# Altium schematic sheet FrontEnd_PS.SchDoc: FMC SDR Frontend
size 420 x 297 mm; CheckedBy: -; CompanyName: CERN; DrawnBy: DrawnBy; Organization: CERN; Address1: European Organization for Nuclear Research; Address2: CH-1211 Genčve 23 - Switzerland; Revision: -; SheetNumber: -; SheetTotal: -; EDA_Number: EDA-XXXXX-VX-X; Projet: -; ModifiedBy: -; CreateDate: XX/XX/XXXX; CheckedDate: -; Title2: Power Supply Top sheet; DivGrp: TE/MPE; Designer: Designer; ModifiedDate: -
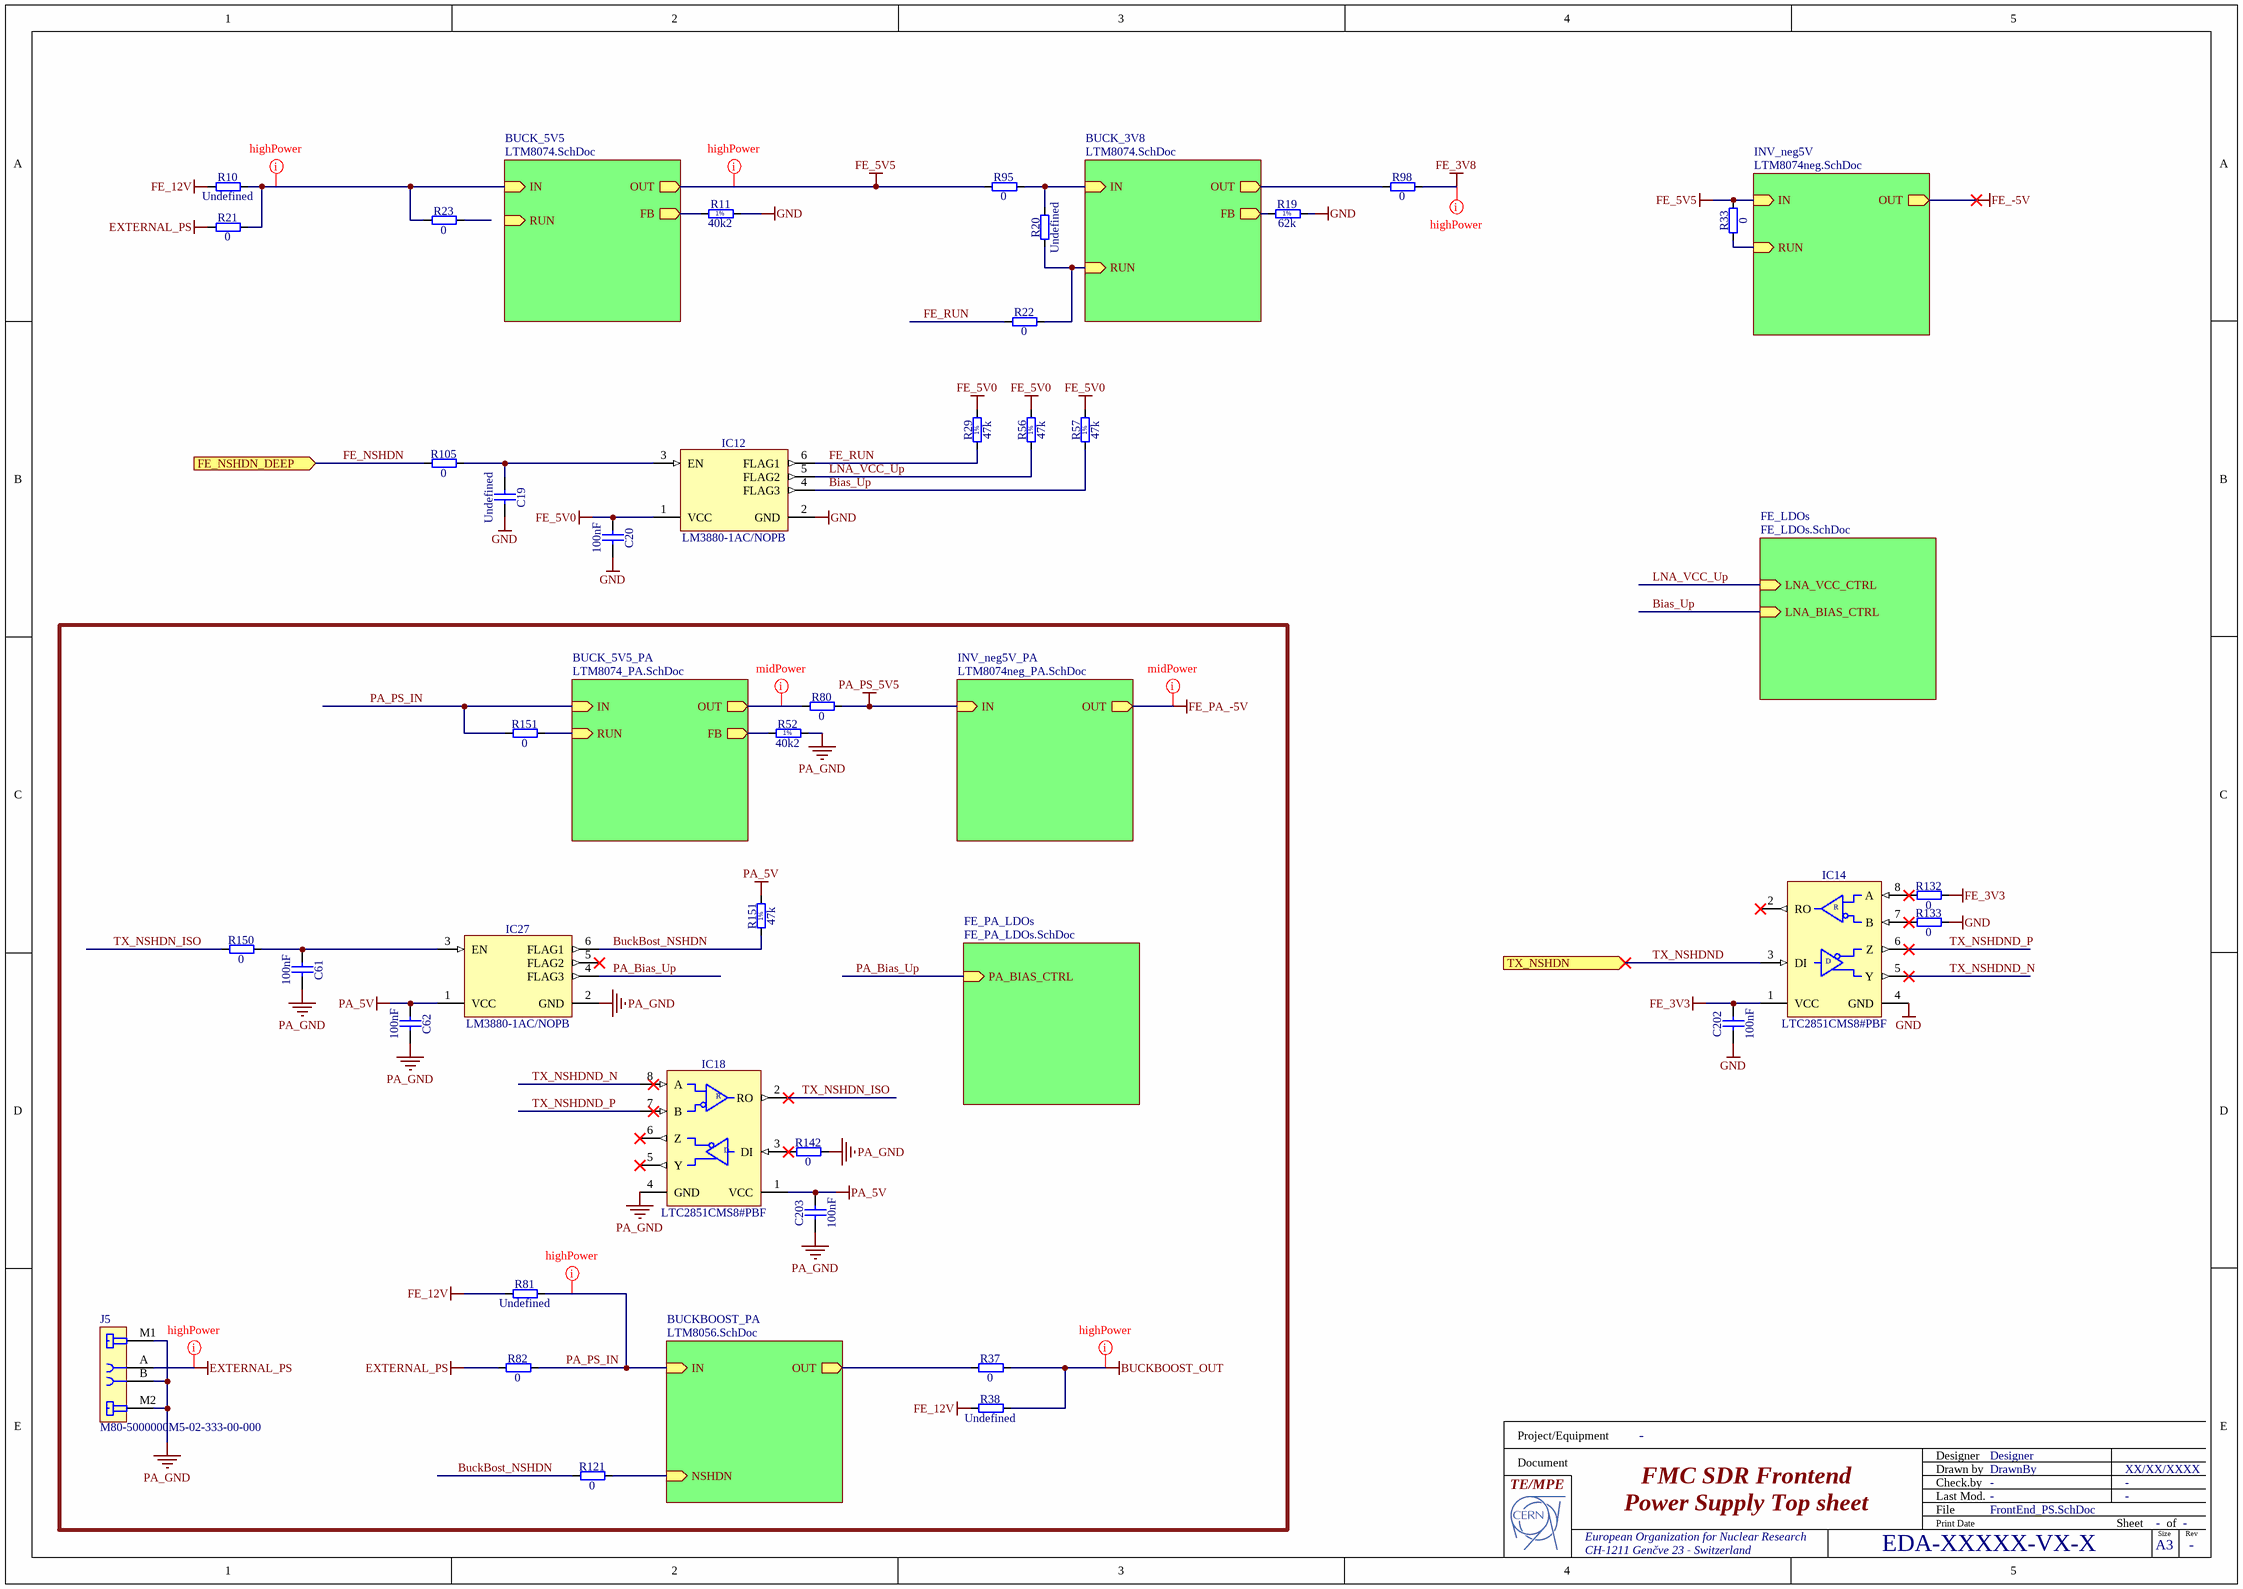
[diagram p0: FrontEnd_PS.SchDoc]

## Parts
(Parts that share a designator on the sheet are numbered #1, #2 ... from top to bottom, then left to right.)
C19  Undefined  [CAPC1005X55N]
C20  100nF  [CAPC1005X55N]
C61  100nF  [CAPC1005X55N]
C62  100nF  [CAPC1005X55N]
C202  100nF  [CAPC1005X55N]
C203  100nF  [CAPC1005X55N]
IC12  LM3880-1AC/NOPB  [SOT95P280X145-6N]
IC14  LTC2851CMS8#PBF  [SOP65P490X110-8N]
IC18  LTC2851CMS8#PBF  [SOP65P490X110-8N]
IC27  LM3880-1AC/NOPB  [SOT95P280X145-6N]
J5  M80-5000000M5-02-333-00-000  [M80-5000000M5-02-333-00-000]
R10  Undefined  [RESC3216X65N]
R11  40k2  [RESC2012X60N]
R19  62k  [RESC2012X60N]
R20  Undefined  [RESC1608X55N]
R21  0  [RESC3216X65N]
R22  0  [RESC1608X55N]
R23  0  [RESC1608X55N]
R29  47k  [RESC1608X55N]
R33  0  [RESC1608X55N]
R37  0  [RESC3216X65N]
R38  Undefined  [RESC3216X65N]
R52  40k2  [RESC2012X60N]
R56  47k  [RESC1608X55N]
R57  47k  [RESC1608X55N]
R80  0  [RESC3216X65N]
R81  Undefined  [RESC3216X65N]
R82  0  [RESC3216X65N]
R95  0  [RESC3216X65N]
R98  0  [RESC3216X65N]
R105  0  [RESC1608X55N]
R121  0  [RESC1608X55N]
R132  0  [RESC1608X55N]
R133  0  [RESC1608X55N]
R142  0  [RESC1608X55N]
R150  0  [RESC1608X55N]
R151#1  0  [RESC1608X55N]
R151#2  47k  [RESC1608X55N]

## Sub-sheets
BUCK_3V8 = LTM8074.SchDoc: IN (in), OUT (out), FB (out), RUN (in)
BUCK_5V5 = LTM8074.SchDoc: IN (in), OUT (out), FB (out), RUN (in)
BUCK_5V5_PA = LTM8074_PA.SchDoc: IN (in), OUT (out), FB (out), RUN (in)
BUCKBOOST_PA = LTM8056.SchDoc: IN (in), OUT (out), NSHDN (in)
FE_LDOs = FE_LDOs.SchDoc: LNA_VCC_CTRL (in), LNA_BIAS_CTRL (in)
FE_PA_LDOs = FE_PA_LDOs.SchDoc: PA_BIAS_CTRL (in)
INV_neg5V = LTM8074neg.SchDoc: IN (in), OUT (out), RUN (in)
INV_neg5V_PA = LTM8074neg_PA.SchDoc: IN (in), OUT (out)

## Ports
FE_NSHDN_DEEP (in), TX_NSHDN (in)

## Nets
BUCKBOOST_OUT: R37.2 R38.2
EXTERNAL_PS: J5.A R21.1 R82.1
FE_3V3: C202.2 IC14.1(VCC) R132.2
FE_3V8: R98.2
FE_5V0: C20.2 IC12.1(VCC) R29.2 R56.2 R57.2
FE_5V5: R33.2 R95.1 ; sheet INV_neg5V/IN, sheet BUCK_5V5/OUT
FE_12V: R10.1 R38.1 R81.1
FE_-5V: sheet INV_neg5V/OUT
FE_PA_-5V: sheet INV_neg5V_PA/OUT
GND: C19.1 C20.1 C202.1 IC12.2(GND) IC14.4(GND) R11.2 R19.2 R133.2
PA_5V: C62.2 C203.2 IC18.1(VCC) IC27.1(VCC) R151#2.2
PA_GND: C61.1 C62.1 C203.1 IC18.4(GND) IC27.2(GND) J5.B J5.M1 J5.M2 R52.2 R142.2
PA_PS_5V5: R80.2 ; sheet INV_neg5V_PA/IN
Bias_Up: IC12.4(FLAG3) R57.1 ; sheet FE_LDOs/LNA_BIAS_CTRL
BuckBost_NSHDN: IC27.6(FLAG1) R121.1 R151#2.1
FE_NSHDN: R105.1 ; port FE_NSHDN_DEEP
FE_RUN: IC12.6(FLAG1) R22.1 R29.1
LNA_VCC_Up: IC12.5(FLAG2) R56.1 ; sheet FE_LDOs/LNA_VCC_CTRL
PA_Bias_Up: IC27.4(FLAG3) ; sheet FE_PA_LDOs/PA_BIAS_CTRL
PA_PS_IN: R81.2 R82.2 R151#1.1 ; sheet BUCKBOOST_PA/IN, sheet BUCK_5V5_PA/IN
TX_NSHDN_ISO: IC18.2(RO) R150.1
TX_NSHDND: IC14.3(DI) ; port TX_NSHDN
TX_NSHDND_N: IC14.5(Y) IC18.8(A)
TX_NSHDND_P: IC14.6(Z) IC18.7(B)
NetC19_2: C19.2 IC12.3(EN) R105.2
NetC61_2: C61.2 IC27.3(EN) R150.2
NetIC14_7: IC14.7(B) R133.1
NetIC14_8: IC14.8(A) R132.1
NetIC18_3: IC18.3(DI) R142.1
NetR10_2: R10.2 R21.2 R23.1 ; sheet BUCK_5V5/IN
NetR11_1: R11.1 ; sheet BUCK_5V5/FB
NetR19_1: R19.1 ; sheet BUCK_3V8/FB
NetR20_1: R20.1 R22.2 ; sheet BUCK_3V8/RUN
NetR20_2: R20.2 R95.2 ; sheet BUCK_3V8/IN
NetR33_1: R33.1 ; sheet INV_neg5V/RUN
NetR37_1: R37.1 ; sheet BUCKBOOST_PA/OUT
NetR52_1: R52.1 ; sheet BUCK_5V5_PA/FB
NetR80_1: R80.1 ; sheet BUCK_5V5_PA/OUT
NetR98_1: R98.1 ; sheet BUCK_3V8/OUT
NetR121_2: R121.2 ; sheet BUCKBOOST_PA/NSHDN
NetR151#1_2: R151#1.2 ; sheet BUCK_5V5_PA/RUN

Not connected (* = marked no-connect by the designer): IC14 2(RO)*; IC18 5(Y)* 6(Z)*; IC27 5(FLAG2)*; R23 2

## Layout directives
net class highPower: BUCKBOOST_OUT, EXTERNAL_PS, FE_3V8, FE_5V5, NetR10_2, PA_PS_IN
net class midPower: FE_PA_-5V, NetR80_1

## Notes on the sheet
- (near R37) Now 20V.
- Project/Equipment
- Document
- Designer
- Drawn by
- Check.by
- File
- Last Mod.
- Print Date
- Sheet
- Size
- A3
- of
- Rev
- (in symbol LTC2851CMS8#PBF) R; D
- (in symbol R0603_47K_1%_0.1W_100PPM) 1%
- (in symbol R0805_40K2_1%_0.125W_100PPM) 1%
- (in symbol R0805_62K_1%_0.125W_100PPM) 1%

## Library data of the parts
C19 = CC0402_NO-VALUE: Non-polarised capacitor; Part Description: Reserved Footprint For 0402(1005) Chip Ceramic Capacitor; Mounted: No; Part Number: CC0402_NO-VALUE; Component Kind: Standard; Component Type: Standard; Pin Count: 2; Value: Undefined; Status: None; Manufacturer: Undefined; Manufacturer Part Number: CC0402_NO-VALUE; Case: 0402; Socket: No; SMD: Yes; Sense: No; Manufacturer1 ComponentHeight: 0.55mm; HelpURL: Undefined; Author: CERN DEM JLC; CreateDate: 14.01.2014; LatestRevisionDate: 14.01.2014
C20 C61 C62 C202 C203 = CC0402_100NF_16V_10%_X7R: Non-polarised capacitor; Part Description: SMD Multilayer Chip Ceramic Capacitor; Manufacturer: GENERIC; Manufacturer1 Part Number: GRM155R71C104KA88D; Voltage: 16V; TC: X7R; Tolerance: ±10%; Part Number: CC0402_100NF_16V_10%_X7R; Component Kind: Standard; Component Type: Standard; Pin Count: 2; Value: 100nF; Status: Not Recommended; Manufacturer Part Number: CC0402_100NF_16V_10%_X7R; Case: 0402; Mounted: Yes; Socket: No; SMD: Yes; Sense: No; Manufacturer1 Example: MURATA; Manufacturer1 ComponentHeight: 0.55mm; HelpURL: \\cern.ch\dfs\Applications\Altium\Datasheets\CC0402_X7R_MURATA_GRM.pdf; Author: CERN DEM JLC; CreateDate: 05.12.2013; LatestRevisionDate: 03.12.2007
IC12 IC27 = LM3880-1AC/NOPB: Simple Power Sequencer; Part Description: Simple Power Sequencer, Power UP : 1 2 3, Power Down 3 2 1, Timing Designator 60ms; Manufacturer: TEXAS INSTRUMENTS; PressFit: No; Bonding: No; Part Number: LM3880-1AC/NOPB; Component Kind: Standard; Component Type: Standard; Device: LM3880-1AC/NOPB; PackageDescription: SOT23, 6-Leads, Body 1.6x3.0mm, Pitch 0.95mm, IPC Medium Density; Manufacturer Part Number: LM3880-1AC/NOPB; Pin Count: 6; Case: SOT23-6; Mounted: Yes; Socket: No; SMD: Yes; Sense: No; ComponentHeight: 1.45mm; Author: CERN DEM MR; HelpURL: \\cern.ch\dfs\Applications\Altium\Datasheets\LM3880-1AC-NOPB.pdf; CreateDate: 17.03.2016; LatestRevisionDate: 17.03.2016
IC14 IC18 = LTC2851CMS8#PBF: 3.3V 20Mbps RS485/RS422 Transceivers; Manufacturer: LINEAR TECHNOLOGY; PressFit: No; Bonding: No; Part Number: LTC2851CMS8#PBF; Component Kind: Standard; Component Type: Standard; Device: LTC2851CMS8#PBF; PackageDescription: SOP, 0.65mm pitch; 8 pin, 3.00mm W X 3.00mm L X 1.10mm H body, IPC Medium Density; Part Description: 3.3V 20Mbps RS485/RS422 Transceivers; Manufacturer Part Number: LTC2851CMS8#PBF; Pin Count: 8; Case: MSOP8; Mounted: Yes; Socket: No; SMD: Yes; Sense: No; ComponentHeight: 1.1mm; HelpURL: \\cern.ch\dfs\Applications\Altium\Datasheets\LTC2851CMS8#PBF.pdf; Author: CERN DEM JLC; CreateDate: 14.12.2010; LatestRevisionDate: 14.12.2010
J5 = CON_M80-5000000M5-02-333-00-000: 2pin (2 power), THT socket with M2 jackscrews; Manufacturer: Harwin; Part Number: M80-5L10405M5-02-333-00-000; Bonding: No; ComponentHeigth: 6.05mm; PressFit: No; Case: M80-5000000M5-02-333-00-000; Component Kind: Standard; Component Type: Standard; CreateDate: 2018-06-18; Device: M80-5000000M5-02-333-00-000; HelpURL: https://www.harwin.com/products/M80-5000000M5-02-333-00-000/; LatestRevisionDate: 2018-06-18; Manufacturer Part Number: M80-5000000M5-02-333-00-000; Mounted: Yes; PackageDescription: H=6.05mm, W=18mm, D=8.6mm; Part Description: 2pin (2 power), THT socket with M2 jackscrews; Pin Count: 6; Sense: No; SMD: No; Socket: No; Value: *
R10 R38 R81 = R1206_NO-VALUE: Resistor; Part Description: Reserved Footprint For a 1206 (3216) Chip Resistor; PressFit: No; Mounted: No; Part Number: R1206_NO-VALUE; Component Kind: Standard; Component Type: Standard; Pin Count: 2; Value: Undefined; Status: None; Manufacturer: Undefined; Manufacturer Part Number: R1206_NO-VALUE; Case: 1206; Sense: No; Socket: No; SMD: Yes; Manufacturer1 Example: Undefined; Manufacturer1 Part Number: Undefined; Manufacturer1 ComponentHeight: 0.65mm; HelpURL: Undefined; Author: CERN DEM JLC; CreateDate: 03.12.2007; LatestRevisionDate: 13.03.2008
R11 R52 = R0805_40K2_1%_0.125W_100PPM: Resistor - 1%; Part Description: Thick Film Chip Resistor; Manufacturer: VISHAY; Manufacturer1 Part Number: CRCW080540K2FKEA; Power: 0.125W; TC: ±100ppm/°C; PressFit: No; Part Number: R0805_40K2_1%_0.125W_100PPM; Component Kind: Standard; Component Type: Standard; Pin Count: 2; Value: 40k2; Status: None; Tolerance: ±1%; Manufacturer Part Number: R0805_40K2_1%_0.125W_100PPM; Case: 0805; Mounted: Yes; Sense: No; Socket: No; SMD: Yes; Manufacturer1 Example: VISHAY; Manufacturer1 ComponentHeight: 0.6mm; HelpURL: \\cern.ch\dfs\Applications\Altium\Datasheets\R2512_VISHAY_CRCW0805.pdf; Author: CERN DEM JLC; CreateDate: 18.04.2013; LatestRevisionDate: 18.04.2013
R19 = R0805_62K_1%_0.125W_100PPM: Resistor - 1%; Part Description: General Purpose Thick Film Chip Resistor; Manufacturer: GENERIC; Manufacturer1 Part Number: NRC10F6202TRF; Power: 0.125W; TC: ±100ppm/°C; PressFit: No; Part Number: R0805_62K_1%_0.125W_100PPM; Component Kind: Standard; Component Type: Standard; Pin Count: 2; Value: 62k; Status: Preferred; Tolerance: ±1%; Manufacturer Part Number: R0805_62K_1%_0.125W_100PPM; Case: 0805; Mounted: Yes; Sense: No; Socket: No; SMD: Yes; Manufacturer1 Example: NIC COMPONENT; Manufacturer1 ComponentHeight: 0.6mm; HelpURL: \\cern.ch\dfs\Applications\Altium\Datasheets\R0805_NIC_NRC.pdf; Author: CERN DEM JLC; CreateDate: 03.12.2007; LatestRevisionDate: 13.03.2008
R20 = R0603_NO-VALUE: Resistor; Part Description: Reserved Footprint For a 0603 (1608) Chip Resistor; PressFit: No; Mounted: No; Part Number: R0603_NO-VALUE; Component Kind: Standard; Component Type: Standard; Pin Count: 2; Value: Undefined; Status: None; Manufacturer: Undefined; Manufacturer Part Number: R0603_NO-VALUE; Case: 0603; Sense: No; Socket: No; SMD: Yes; Manufacturer1 Example: Undefined; Manufacturer1 Part Number: Undefined; Manufacturer1 ComponentHeight: Undefined; HelpURL: Undefined; Author: CERN DEM JLC; CreateDate: 03.12.2007; LatestRevisionDate: 13.03.2008
R21 R37 R80 R82 R95 R98 = R1206_0R_JUMPER: Resistor; Part Description: 2A (0.05R Max DC Resistance) Zero Ohm Jumper; Manufacturer: GENERIC; Manufacturer1 Part Number: NRC12Z0; PressFit: No; Part Number: R1206_0R_JUMPER; Component Kind: Standard; Component Type: Standard; Pin Count: 2; Value: 0; Status: Preferred; Manufacturer Part Number: R1206_0R_JUMPER; Case: 1206; Mounted: Yes; Sense: No; Socket: No; SMD: Yes; Manufacturer1 Example: NIC COMPONENT; Manufacturer1 ComponentHeight: 0.65mm; HelpURL: \\cern.ch\dfs\Applications\Altium\Datasheets\R1206_NIC_NRC.pdf; Author: CERN DEM JLC; CreateDate: 03.12.2007; LatestRevisionDate: 13.03.2008
R22 R23 R33 R105 R121 R132 R133 R142 R150 R151#1 = R0603_0R_JUMPER: Resistor; Part Description: 1A (0.05R Max DC Resistance) Zero Ohm Jumper; Manufacturer: GENERIC; Manufacturer1 Part Number: NRC06Z0; PressFit: No; Part Number: R0603_0R_JUMPER; Component Kind: Standard; Component Type: Standard; Pin Count: 2; Value: 0; Status: Preferred; Manufacturer Part Number: R0603_0R_JUMPER; Case: 0603; Mounted: Yes; Sense: No; Socket: No; SMD: Yes; Manufacturer1 Example: NIC COMPONENT; Manufacturer1 ComponentHeight: 0.55mm; HelpURL: \\cern.ch\dfs\Applications\Altium\Datasheets\R0603_NIC_NRC.pdf; Author: CERN DEM JLC; CreateDate: 03.12.2007; LatestRevisionDate: 13.03.2008
R29 R56 R57 R151#2 = R0603_47K_1%_0.1W_100PPM: Resistor - 1%; Part Description: General Purpose Thick Film Chip Resistor; Manufacturer: GENERIC; Manufacturer1 Part Number: NRC06F4702TRF; PressFit: No; Power: 0.1W; TC: ±100ppm/°C; Part Number: R0603_47K_1%_0.1W_100PPM; Component Kind: Standard; Component Type: Standard; Pin Count: 2; Value: 47k; Status: Preferred; Manufacturer Part Number: R0603_47K_1%_0.1W_100PPM; Case: 0603; Mounted: Yes; Sense: No; Socket: No; SMD: Yes; Manufacturer1 Example: NIC COMPONENT; Manufacturer1 ComponentHeight: 0.55mm; HelpURL: \\cern.ch\dfs\Applications\Altium\Datasheets\R0603_NIC_NRC.pdf; Author: CERN DEM JLC; CreateDate: 03.12.2007; LatestRevisionDate: 13.03.2008; Tolerance: ±1%